# Altium project Oscilloscope.PrjPcb
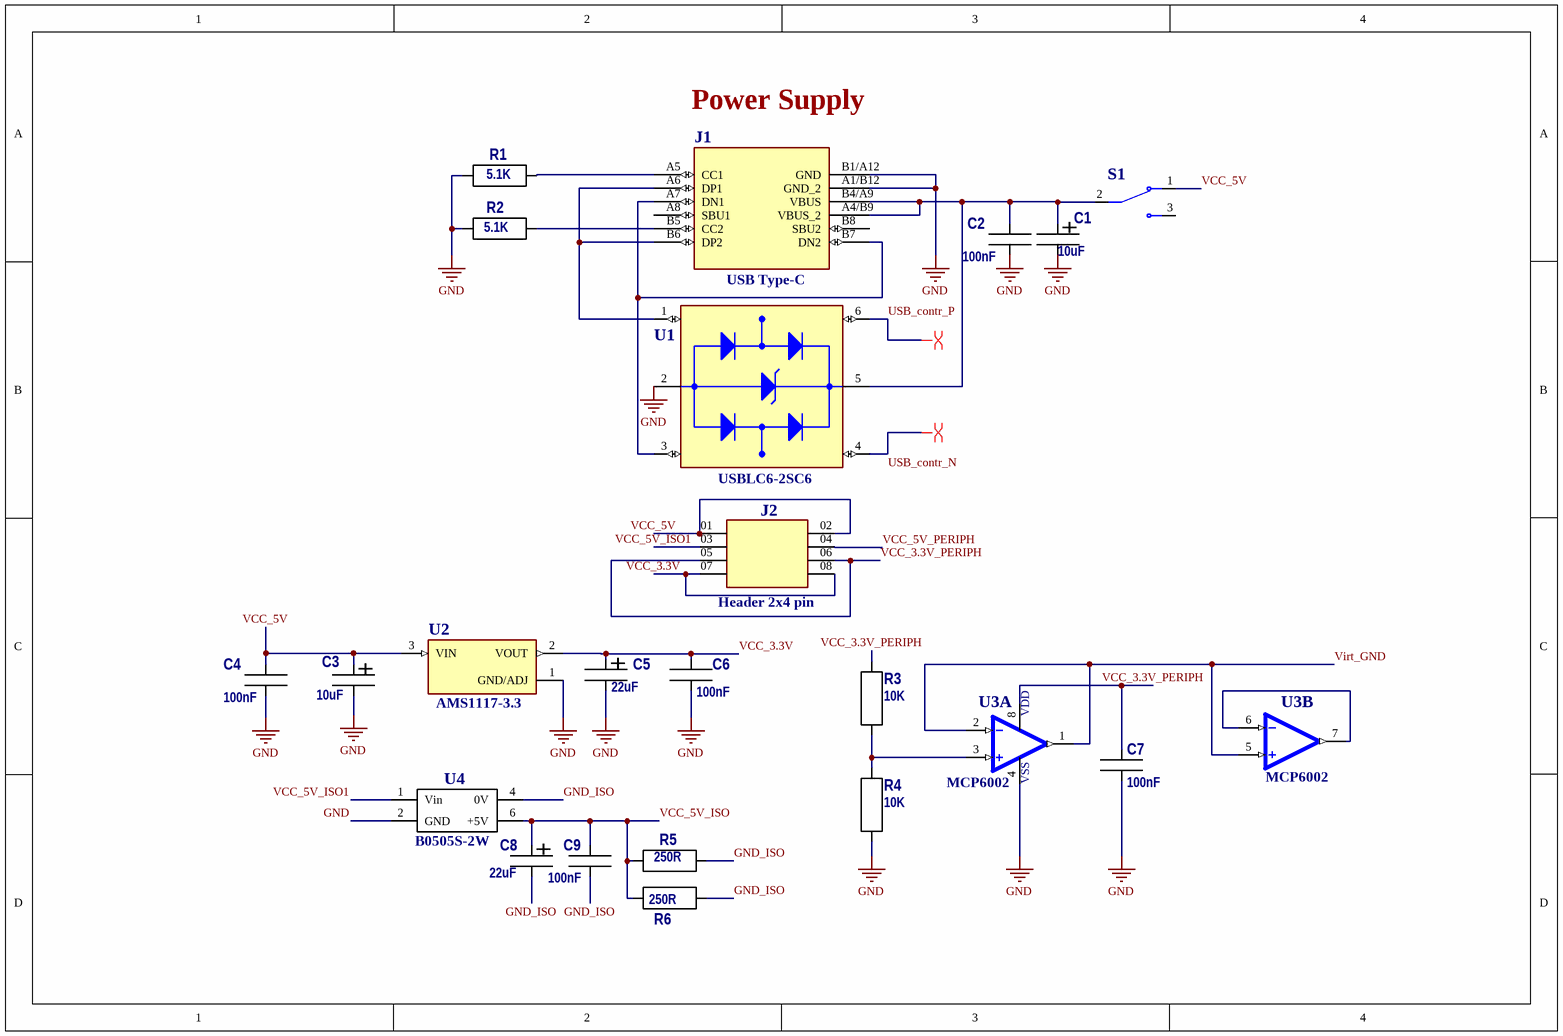
[diagram p0: Power_supply.SchDoc]
5 sheets, 124 parts. Net scope: global (net labels, ports and power ports of the same name join across sheets).
Board file: oscill_pcb.PcbDoc
Sheets:
  Power_supply.SchDoc
  Channel_input.SchDoc
  Relay_switcher.SchDoc
  ADC.SchDoc
  Controller.SchDoc

## Sheet Power_supply.SchDoc
size A4; SheetNumber: 1; SheetTotal: 5

### Parts
C1  10uF  [Tant B]
C2  100nF  [Cap 0805 3D]
C3  10uF  [Tant B]
C4  100nF  [Cap 0805 3D]
C5  22uF  [Tant B]
C6  100nF  [Cap 0805 3D]
C7  100nF  [Cap 0805 3D]
C8  22uF  [Tant B]
C9  100nF  [Cap 0805 3D]
J1  USB Type-C  [216990-0002_MOL]
J2  Header 2x4 pin  [SAMTEC_TSW-104-08-T-D]
R1  5.1K  [Res_0805 3D]
R2  5.1K  [Res_0805 3D]
R3  10K  [Res_1206 3D]
R4  10K  [Res_1206 3D]
R5  250R  [Res_1206 3D]
R6  250R  [Res_1206 3D]
S1  STS121RA04  [TE_STS121RA04]  (value not drawn)
U1  USBLC6-2SC6  [SOT95P280X145-6N]
U2  AMS1117-3.3  [SOT229P700X180-4N]
U3  MCP6002  [SOIC127P600X175-8N]  (parts A,B of 2)
U4  B0505S-2W  [B0505S-2W]

### Nets
GND: C1.2(-) C2.2 C3.2(-) C4.2 C5.2(-) C6.2 C7.2 J1.A1/B12(GND_2) J1.B1/A12(GND) R1.2 R2.2 R4.1 U1.2(GND) U2.1(GND/ADJ) U3.4(VSS) U4.2(GND)
GND_ISO: C8.2(-) C9.2 R5.1 R6.1 U4.4(0V)
USB_contr_N: U1.4(I/O2_OUT)
USB_contr_P: U1.6(I/O1_OUT)
VCC_3.3V: C5.1(+) C6.1 J2.07 J2.08 U2.2(VOUT)
VCC_3.3V_PERIPH: C7.1 J2.05 J2.06 R3.2 U3.8(VDD)
VCC_5V: C3.1(+) C4.1 J2.01 J2.02 S1.1 U2.3(VIN)
VCC_5V_ISO: C8.1(+) C9.1 R5.2 R6.2 U4.6(+5V)
VCC_5V_ISO1: J2.03 U4.1(Vin)
VCC_5V_PERIPH: J2.04
Virt_GND: U3.1(VOUTA) U3.2(VINA-) U3.5(VINB+)
NetC1_1: C1.1(+) C2.1 J1.A4/B9(VBUS_2) J1.B4/A9(VBUS) S1.2 U1.5(VBUS)
NetJ1_A5: J1.A5(CC1) R1.1
NetJ1_A6: J1.A6(DP1) J1.B6(DP2) U1.1(I/O1_IN)
NetJ1_A7: J1.A7(DN1) J1.B7(DN2) U1.3(I/O2_IN)
NetJ1_B5: J1.B5(CC2) R2.1
NetR3_1: R3.1 R4.2 U3.3(VINA+)
NetU3_6: U3.6(VINB-) U3.7(VOUTB)

Not connected (* = marked no-connect by the designer): J1 A8(SBU1) B8(SBU2); S1 3

### Layout directives
differential pair: USB_contr_N, USB_contr_P

### Notes on the sheet
- Power Supply

### Library data of the parts
C1 C3 = C T: SMD type B 10 uF min 16V
C2 C4 C6 C7 C9 = C: SMD 0805 100nF
C5 C8 = C T: SMD type B 22 uF min 16V
J1 = 2169900002: MF: {'manufacturer': u'Molex'}; Package: None; Price: None; Value: *; MP: 2169900002; Availability: Unavailable
J2 = TSW-104-08-T-D: Package: None; Price: None; Value: *; MP: TSW-104-08-T-D; Availability: Unavailable
R1 R2 = R: 0603 0.1%
R3-R6 = R: 0805 10K
S1 = STS121RA04: Slide Switch SPDT Through Hole, Right Angle; MF: TE Connectivity; SnapEDA_Link: https://www.snapeda.com/parts/STS121RA04/TE+Connectivity+ALCOSWITCH+Switches/view-part/?ref=snap; Package: None; Value: *; MP: STS121RA04; Check_prices: https://www.snapeda.com/parts/STS121RA04/TE+Connectivity+ALCOSWITCH+Switches/view-part/?ref=eda
U1 = USBLC6-2SC6: 17V Clamp 5A (8/20Âµs) Ipp Tvs Diode Surface Mount SOT-23-6; MF: STMicroelectronics; Value: *; SnapEDA_Link: https://www.snapeda.com/parts/USBLC6-2SC6/STMicroelectronics/view-part/?ref=snap; Check_prices: https://www.snapeda.com/parts/USBLC6-2SC6/STMicroelectronics/view-part/?ref=eda; Purchase-URL: https://pricing.snapeda.com/search/part/USBLC6-2SC6/?ref=eda; Price: None; Availability: In Stock; Package: SOT-23-6 STMicroelectronics; MP: USBLC6-2SC6
U2 = AMS1117-5.0: 1A LOW DROPOUT VOLTAGE REGULATOR; MF: ams; MP: AMS1117-5.0; Package: SOT-223 Seeed Technology; SnapEDA_Link: https://www.snapeda.com/parts/AMS1117-5.0/ams/view-part/?ref=snap; Check_prices: https://www.snapeda.com/parts/AMS1117-5.0/ams/view-part/?ref=eda; Availability: Not in stock; Value: *; Price: None
U3 = MCP6002-I/SN: Microchip , Dual Op Amp, 1MHzCMOS, Rail to Rail, 3V, 5V, 8-Pin SOIC | Microchip Technology Inc. MCP6002-I/SN; SnapEDA_Link: https://www.snapeda.com/parts/MCP6002-I/SN/Microchip/view-part/?ref=snap; Package: SO-8 Microchip; Value: *; MF: Microchip; MP: MCP6002-I/SN; Check_prices: https://www.snapeda.com/parts/MCP6002-I/SN/Microchip/view-part/?ref=eda
U4 = B0505S-2W: Изолированный DC-DC преобразователь, вход 5В, выход 5В 3Вт

## Sheet Channel_input.SchDoc
size A4; SheetNumber: 2; SheetTotal: 5
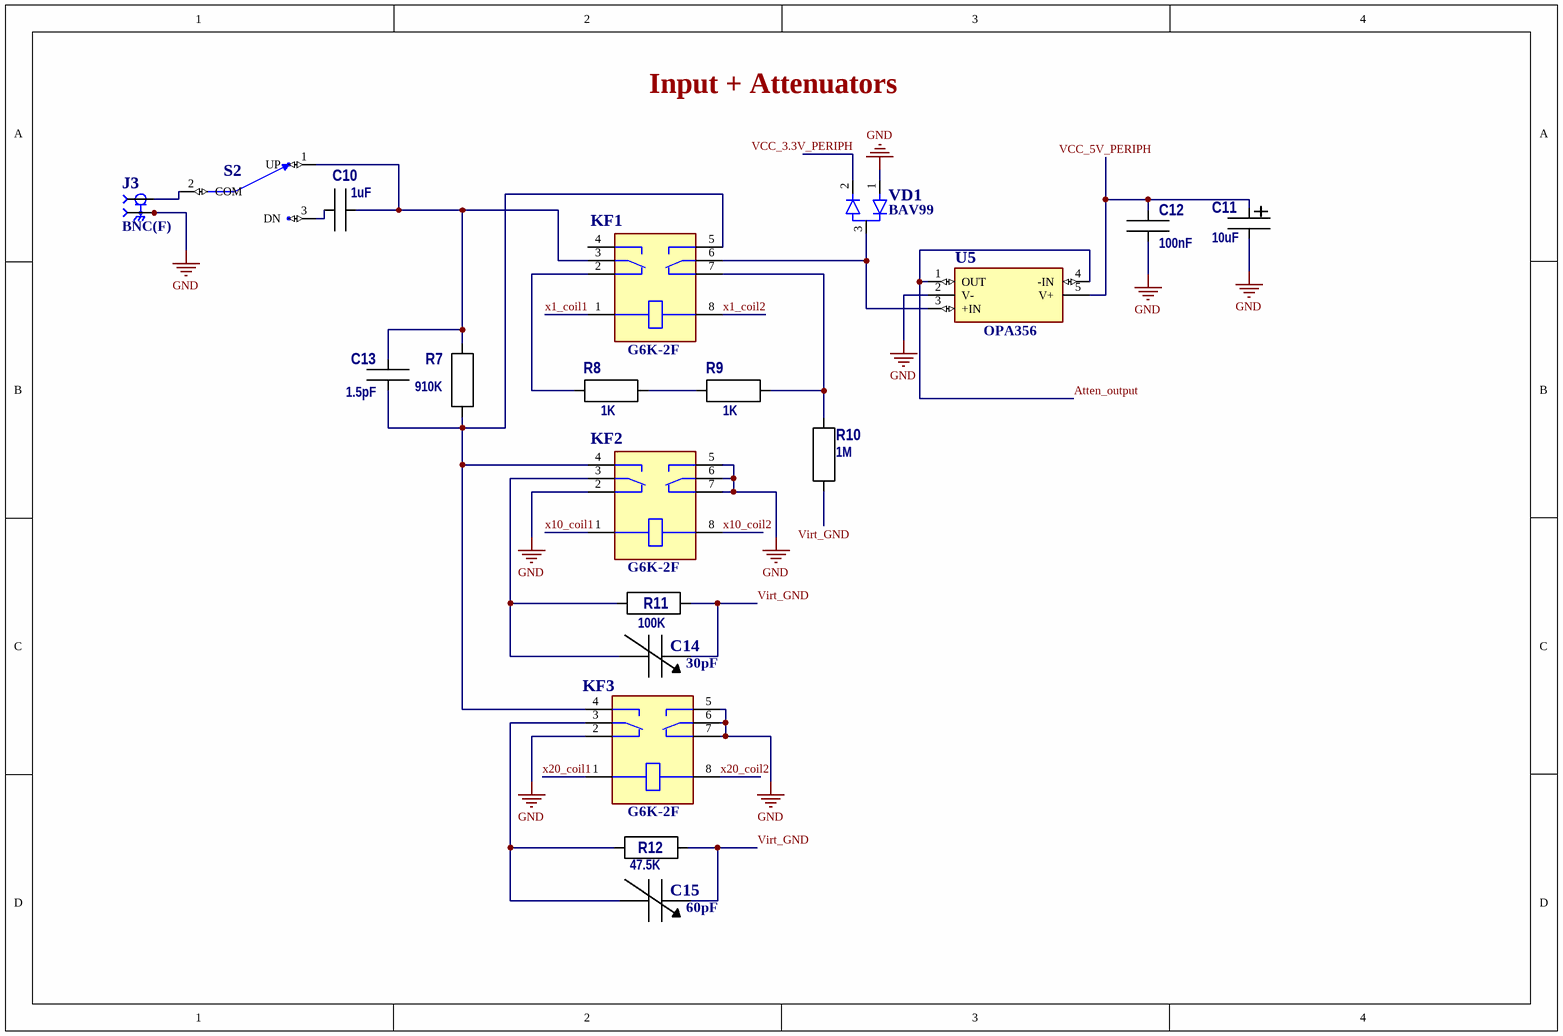
[diagram p1: Channel_input.SchDoc]

### Parts
C10  1uF  [C__s 5-d 5.5-t4]
C11  10uF  [Tant B]
C12  100nF  [CAP 0603 3D]
C13  1.5pF  [CAP 0603 3D]
C14  30pF  [Cvar]
C15  60pF  [Cvar]
J3  BNC(F)  [SAMTEC_BNC7T-J-P-XX-RA-BH1]
KF1  G6K-2F  [RELAY_G6K-2F]
KF2  G6K-2F  [RELAY_G6K-2F]
KF3  G6K-2F  [RELAY_G6K-2F]
R7  910K  [Res_1206 3D]
R8  1K  [Res_1206 3D]
R9  1K  [Res_1206 3D]
R10  1M  [Res_1206 3D]
R11  100K  [Res_1206 3D]
R12  47.5K  [Res_1206 3D]
S2  100SP1T1B1M7QE  [100SP1T1B1M7QE]  (value not drawn)
U5  OPA356  [SOT95P280X145-5N]
VD1  BAV99  [DIO_BAV99]

### Nets
GND: C11.2(-) C12.2 J3.S1 J3.S2 J3.S3 J3.S4 KF2.2 KF2.5 KF2.6 KF2.7 KF3.2 KF3.5 KF3.6 KF3.7 U5.2(V-) VD1.1
Atten_output: U5.1(OUT) U5.4(-IN)
VCC_3.3V_PERIPH: VD1.2
VCC_5V_PERIPH: C11.1(+) C12.1 U5.5(V+)
Virt_GND: C14.1 C15.1 R10.1 R11.2 R12.2
x1_coil2: KF1.8
x10_coil1: KF1.1 KF2.1 KF3.1  [also labelled x1_coil1, x20_coil1]  [project net VCC_5V_ISO]
x10_coil2: KF2.8
x20_coil2: KF3.8
NetC10_1: C10.1 C13.2 KF1.3 R7.2 S2.1(UP)
NetC10_2: C10.2 S2.3(DN)
NetC13_1: C13.1 KF1.5 KF2.4 KF3.4 R7.1
NetC14_2: C14.2 KF2.3 R11.1
NetC15_2: C15.2 KF3.3 R12.1
NetJ3_1: J3.1 S2.2(COM)
NetKF1_2: KF1.2 R8.2
NetKF1_6: KF1.6 U5.3(+IN) VD1.3
NetKF1_7: KF1.7 R9.1 R10.2
NetR8_1: R8.1 R9.2

Not connected (* = marked no-connect by the designer): KF1 4

### Notes on the sheet
- Input + Attenuators

### Library data of the parts
C10 = C_Disk: Конденсатор керамика
C11 = C T: SMD type B 10 uF min 16V
C12 = C: 0603 100nF X7R
C13 = C: 0603 1.5pF X7R
C14 C15 = Сvar
J3 = BNC7T-J-P-XX-RA-BH1: Connecteur BNC Jack, Embase femelle 75Ohm Montage sur panneau, Traversant, Soudure Ã  angle droit; MP: BNC7T-J-P-HN-RA-BH1; MF: Samtec; Check_prices: https://www.snapeda.com/parts/BNC7T-J-P-HN-RA-BH1/Samtec+Inc./view-part/?ref=eda; Value: *; Availability: In Stock; Price: None; Package: None; SnapEDA_Link: https://www.snapeda.com/parts/BNC7T-J-P-HN-RA-BH1/Samtec+Inc./view-part/?ref=snap; Purchase-URL: https://pricing.snapeda.com/search/part/BNC7T-J-P-HN-RA-BH1/?ref=eda
KF1-KF3 = G6K-2F: Telecom Relay DPDT (2 Form C) Surface Mount; MF: Omron; SnapEDA_Link: https://www.snapeda.com/parts/G6K-2F/Omron/view-part/?ref=snap; Package: TDFN-6 Omron Electronics; Value: *; MP: G6K-2F; Check_prices: https://www.snapeda.com/parts/G6K-2F/Omron/view-part/?ref=eda
R7 = R: 1206 910K
R8 R9 = R: 1 KOhm 1206
R10 = R: 1 MOhm 1206
R11 = R: 100 KOhm 1206
R12 = R: 47.5 KOhm 1206
S2 = 100SP1T1B1M7QE: TOGGLE, 5A, 120VAC/28VDC SPDT, On-On, Panel Mount, Right Angle, Vertical; MF: E-Switch; SnapEDA_Link: https://www.snapeda.com/parts/100SP1T1B1M7QE/E-Switch/view-part/?ref=snap; Package: None; Value: *; MP: 100SP1T1B1M7QE; Check_prices: https://www.snapeda.com/parts/100SP1T1B1M7QE/E-Switch/view-part/?ref=eda
U5 = OPA356AIDBVR: 2.5V, 200MHz GBW, CMOS Single Op Amp; MF: Texas Instruments; SnapEDA_Link: https://www.snapeda.com/parts/OPA356AIDBVR/Texas+Instruments/view-part/?ref=snap; Package: SOT-23-5 Texas Instruments; Value: *; MP: OPA356AIDBVR; Check_prices: https://www.snapeda.com/parts/OPA356AIDBVR/Texas+Instruments/view-part/?ref=eda
VD1 = BAV99: Diode Array 1 Pair Series Connection Standard 100V 215mA (DC) Surface Mount TO-236-3, SC-59, SOT-23-3; MF: ON Semiconductor; Price: None; Availability: In Stock; MP: BAV99; Package: SOT-23-3 Motorola; SnapEDA_Link: https://www.snapeda.com/parts/BAV99/Onsemi/view-part/?ref=snap; Check_prices: https://www.snapeda.com/parts/BAV99/Onsemi/view-part/?ref=eda; Value: *; Purchase-URL: https://pricing.snapeda.com/search/part/BAV99/?ref=eda

## Sheet Relay_switcher.SchDoc
size A4; SheetNumber: 3; SheetTotal: 5
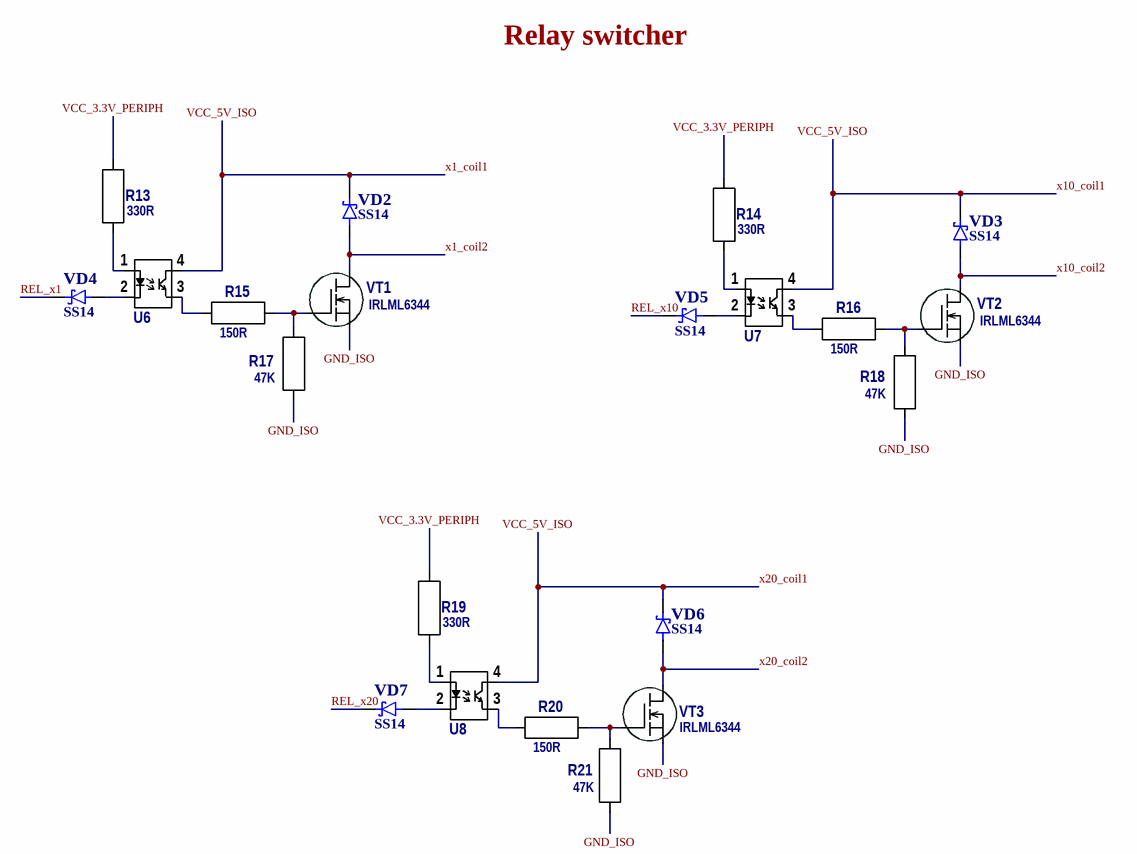
[diagram p2: Relay_switcher.SchDoc]

### Parts
R13  330R  [Res_1206 3D]
R14  330R  [Res_1206 3D]
R15  150R  [Res_1206 3D]
R16  150R  [Res_1206 3D]
R17  47K  [Res_1206 3D]
R18  47K  [Res_1206 3D]
R19  330R  [Res_1206 3D]
R20  150R  [Res_1206 3D]
R21  47K  [Res_1206 3D]
U6  Optocoupler EL817 DIP-4  [DIP-4]  (value not drawn)
U7  Optocoupler EL817 DIP-4  [DIP-4]  (value not drawn)
U8  Optocoupler EL817 DIP-4  [DIP-4]  (value not drawn)
VD2  SS14  [SMA]
VD3  SS14  [SMA]
VD4  SS14  [SMA]
VD5  SS14  [SMA]
VD6  SS14  [SMA]
VD7  SS14  [SMA]
VT1  IRLML6344  [SOT-23-3]
VT2  IRLML6344  [SOT-23-3]
VT3  IRLML6344  [SOT-23-3]

### Nets
GND_ISO: R17.2 R18.2 R21.2 VT1.3(S) VT2.3(S) VT3.3(S)
REL_x1: VD4.P2(C)
REL_x10: VD5.P2(C)
REL_x20: VD7.P2(C)
VCC_3.3V_PERIPH: R13.2 R14.2 R19.2
VCC_5V_ISO: U6.4(C) U7.4(C) U8.4(C) VD2.P2(C) VD3.P2(C) VD6.P2(C)  [also labelled x10_coil1, x1_coil1, x20_coil1]
x1_coil2: VD2.P1(A) VT1.2(D)
x10_coil2: VD3.P1(A) VT2.2(D)
x20_coil2: VD6.P1(A) VT3.2(D)
NetR13_1: R13.1 U6.1(Led_A)
NetR14_1: R14.1 U7.1(Led_A)
NetR15_1: R15.1 U6.3(E)
NetR15_2: R15.2 R17.1 VT1.1(G)
NetR16_1: R16.1 U7.3(E)
NetR16_2: R16.2 R18.1 VT2.1(G)
NetR19_1: R19.1 U8.1(Led_A)
NetR20_1: R20.1 U8.3(E)
NetR20_2: R20.2 R21.1 VT3.1(G)
NetU6_2: U6.2(Led_C) VD4.P1(A)
NetU7_2: U7.2(Led_C) VD5.P1(A)
NetU8_2: U8.2(Led_C) VD7.P1(A)

### Notes on the sheet
- Relay switcher

### Library data of the parts
R13-R21 = R
U6-U8 = EL817: Оптрон выход - транзистор
VD2-VD7 = SS14: Diode Schottky 40 V 1A Surface Mount DO-214AC (SMA); MF: ON; SnapEDA_Link: https://www.snapeda.com/parts/SS14/Onsemi/view-part/?ref=snap; Package: SMA-2 ON Semiconductor; Value: *; MP: SS14; Check_prices: https://www.snapeda.com/parts/SS14/Onsemi/view-part/?ref=eda
VT1-VT3 = VT MOSFET-N: Транзистор MOSFET N-канал IRLML6344

## Sheet ADC.SchDoc
size A4; SheetNumber: 4; SheetTotal: 5
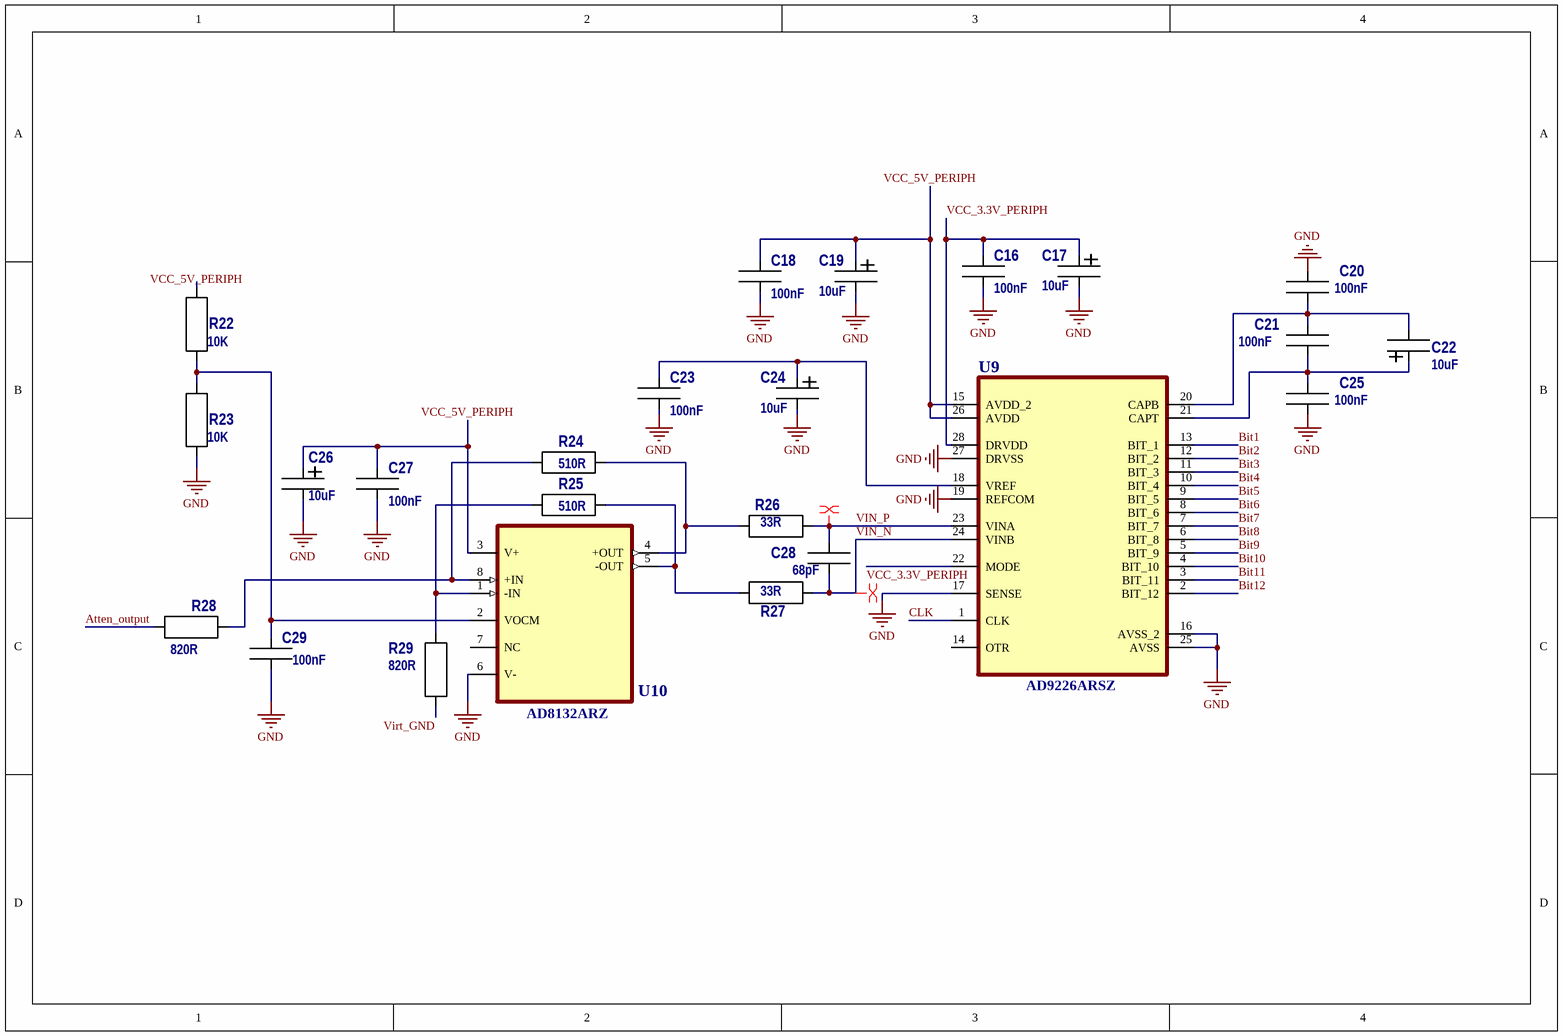
[diagram p3: ADC.SchDoc]

### Parts
C16  100nF  [CAP 0603 3D]
C17  10uF  [Tant B]
C18  100nF  [CAP 0603 3D]
C19  10uF  [Tant B]
C20  100nF  [CAP 0603 3D]
C21  100nF  [CAP 0603 3D]
C22  10uF  [Tant B]
C23  100nF  [CAP 0603 3D]
C24  10uF  [Tant B]
C25  100nF  [CAP 0603 3D]
C26  10uF  [Tant B]
C27  100nF  [cap 1206 3D]
C28  68pF  [CAP 0603 3D]
C29  100nF  [CAP 0603 3D]
R22  10K  [Res_0603 3D]
R23  10K  [Res_0603 3D]
R24  510R  [Res_0603 3D]
R25  510R  [Res_0603 3D]
R26  33R  [Res_0603 3D]
R27  33R  [Res_0603 3D]
R28  820R  [Res_0603 3D]
R29  820R  [Res_0603 3D]
U9  AD9226ARSZ  [SOP65P780X200-28N]
U10  AD8132ARZ  [SOIC127P600X175-8N]

### Nets
GND: C16.2 C17.2(-) C18.2 C19.2(-) C20.1 C23.2 C24.2(-) C25.2 C26.2(-) C27.2 C29.2 R23.1 U9.16(AVSS_2) U9.17(SENSE) U9.19(REFCOM) U9.25(AVSS) U9.27(DRVSS) U10.6(V-)
Atten_output: R28.2
Bit1: U9.13(BIT_1)
Bit2: U9.12(BIT_2)
Bit3: U9.11(BIT_3)
Bit4: U9.10(BIT_4)
Bit5: U9.9(BIT_5)
Bit6: U9.8(BIT_6)
Bit7: U9.7(BIT_7)
Bit8: U9.6(BIT_8)
Bit9: U9.5(BIT_9)
Bit10: U9.4(BIT_10)
Bit11: U9.3(BIT_11)
Bit12: U9.2(BIT_12)
CLK: U9.1(CLK)
VCC_3.3V_PERIPH: C16.1 C17.1(+) U9.22(MODE) U9.28(DRVDD)
VCC_5V_PERIPH: C18.1 C19.1(+) C26.1(+) C27.1 R22.2 U9.15(AVDD_2) U9.26(AVDD) U10.3(V+)
VIN_N: C28.2 R27.1 U9.24(VINB)
VIN_P: C28.1 R26.1 U9.23(VINA)
Virt_GND: R29.2
NetC20_2: C20.2 C21.1 C22.2(-) U9.20(CAPB)
NetC21_2: C21.2 C22.1(+) C25.1 U9.21(CAPT)
NetC23_1: C23.1 C24.1(+) U9.18(VREF)
NetC29_1: C29.1 R22.1 R23.2 U10.2(VOCM)
NetR24_1: R24.1 R26.2 U10.4(+OUT)
NetR24_2: R24.2 R28.1 U10.8(+IN)
NetR25_1: R25.1 R27.2 U10.5(-OUT)
NetR25_2: R25.2 R29.1 U10.1(-IN)

Not connected (* = marked no-connect by the designer): U9 14(OTR); U10 7(NC)

### Layout directives
differential pair: VIN_N, VIN_P

### Library data of the parts
C16 C18 C20 C21 C23 C25 C27 C29 = C: 0603 100nF X7R
C17 C19 C22 C24 C26 = C T: SMD type B 10 uF min 16V
C28 = C: 0805 68pF NP0 (C0G)
R22 R23 = R: 10K 0805
R24-R29 = R: 0805 0.1%
U9 = AD9226ARSZ: 12-Bit, 65 MSPS Analog-to-Digital Converter; MF: Analog Devices; SnapEDA_Link: https://www.snapeda.com/parts/AD9226ARSZ/Analog+Devices/view-part/?ref=snap; Package: SSOP-28 Analog Devices; Value: *; MP: AD9226ARSZ; Check_prices: https://www.snapeda.com/parts/AD9226ARSZ/Analog+Devices/view-part/?ref=eda
U10 = AD8132ARZ: Low Cost, High Speed Differential Amplifier; MF: Analog Devices; SnapEDA_Link: https://www.snapeda.com/parts/AD8132ARZ/Analog+Devices/view-part/?ref=snap; Package: SOIC-8 Analog Devices; Value: *; MP: AD8132ARZ; Check_prices: https://www.snapeda.com/parts/AD8132ARZ/Analog+Devices/view-part/?ref=eda

## Sheet Controller.SchDoc
size A4; SheetNumber: 5; SheetTotal: 5
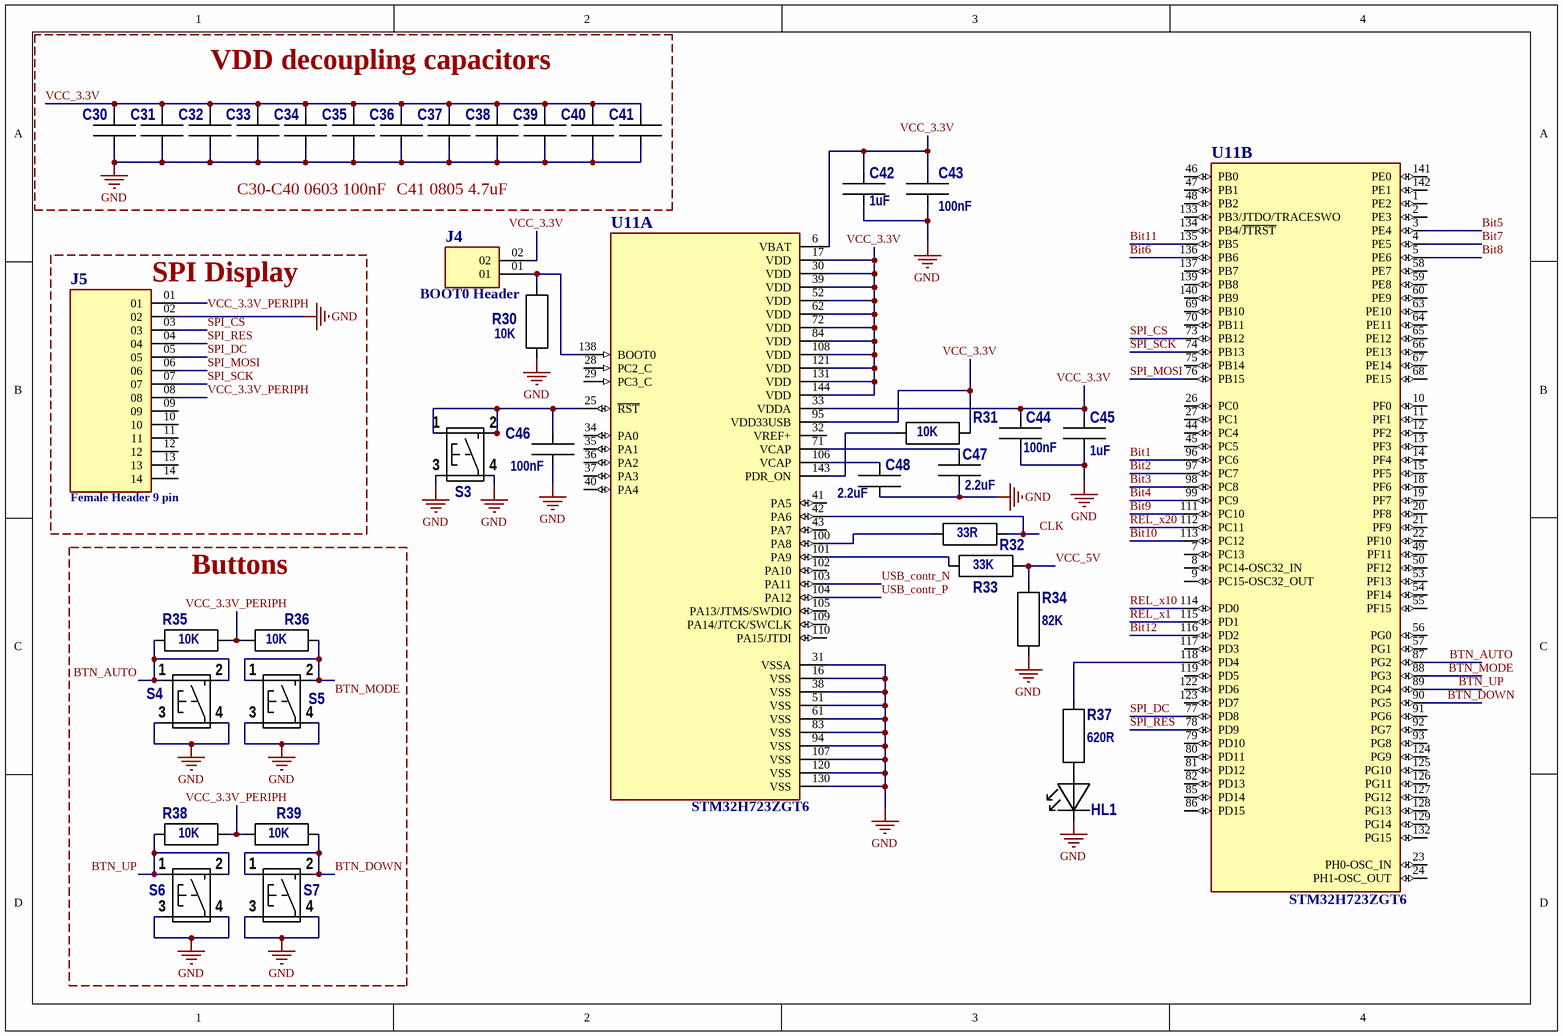
[diagram p4: Controller.SchDoc]

### Parts
C30  100nF  [CAP 0603 3D]  (value not drawn)
C31  100nF  [CAP 0603 3D]  (value not drawn)
C32  100nF  [CAP 0603 3D]  (value not drawn)
C33  100nF  [CAP 0603 3D]  (value not drawn)
C34  100nF  [CAP 0603 3D]  (value not drawn)
C35  100nF  [CAP 0603 3D]  (value not drawn)
C36  100nF  [CAP 0603 3D]  (value not drawn)
C37  100nF  [CAP 0603 3D]  (value not drawn)
C38  100nF  [CAP 0603 3D]  (value not drawn)
C39  100nF  [CAP 0603 3D]  (value not drawn)
C40  100nF  [CAP 0603 3D]  (value not drawn)
C41  4.7uF  [Cap 0805 3D]  (value not drawn)
C42  1uF  [Cap 0805 3D]
C43  100nF  [CAP 0603 3D]
C44  100nF  [CAP 0603 3D]
C45  1uF  [Cap 0805 3D]
C46  100nF  [CAP 0603 3D]
C47  2.2uF  [Cap 0805 3D]
C48  2.2uF  [Cap 0805 3D]
HL1  fyls-0805???  [СД_SMD 2012_110]  (value not drawn)
J4  BOOT0 Header  [SAMTEC_HTSW-102-07-TM-S]
J5  Female Header 9 pin  [SAMTEC_SSQ-114-02-T-S]
R30  10K  [Res_0603 3D]
R31  10K  [Res_0603 3D]
R32  33R  [Res_0603 3D]
R33  33K  [Res_0603 3D]
R34  82K  [Res_0603 3D]
R35  10K  [Res_0603 3D]
R36  10K  [Res_0603 3D]
R37  620R  [Res_0603 3D]
R38  10K  [Res_0603 3D]
R39  10K  [Res_0603 3D]
S3  SWT-20-12.5  [250 _ 6,0-6,0-12,5]  (value not drawn)
S4  SWT-20-12.5  [250 _ 6,0-6,0-12,5]  (value not drawn)
S5  SWT-20-12.5  [250 _ 6,0-6,0-12,5]  (value not drawn)
S6  SWT-20-12.5  [250 _ 6,0-6,0-12,5]  (value not drawn)
S7  SWT-20-12.5  [250 _ 6,0-6,0-12,5]  (value not drawn)
U11  STM32H723ZGT6  [QFP50P2200X2200X160-144N]  (parts A,B of 2)

### Blocks framed on the sheet
VDD decoupling capacitors: C30-C41
SPI Display: J5
Buttons: R35 R36 R38 R39 S4-S7

### Nets
GND: C30.1 C31.1 C32.1 C33.1 C34.1 C35.1 C36.1 C37.1 C38.1 C39.1 C40.2 C41.1 C42.1 C43.2 C44.2 C45.1 C46.2 C47.1 C48.1 HL1.1(K) J5.02 R30.1 R34.2 S3.3 S3.4 S4.3 S4.4 S5.3 S5.4 S6.3 S6.4 S7.3 S7.4 U11.16(VSS) U11.31(VSSA) U11.38(VSS) U11.51(VSS) U11.61(VSS) U11.83(VSS) U11.94(VSS) U11.107(VSS) U11.120(VSS) U11.130(VSS)
Bit1: U11.96(PC6)
Bit2: U11.97(PC7)
Bit3: U11.98(PC8)
Bit4: U11.99(PC9)
Bit5: U11.3(PE4)
Bit6: U11.136(PB6)
Bit7: U11.4(PE5)
Bit8: U11.5(PE6)
Bit9: U11.111(PC10)
Bit10: U11.113(PC12)
Bit11: U11.135(PB5)
Bit12: U11.116(PD2)
BTN_AUTO: R35.2 S4.1 S4.2 U11.87(PG2)
BTN_DOWN: R39.1 S7.1 S7.2 U11.90(PG5)
BTN_MODE: R36.1 S5.1 S5.2 U11.88(PG3)
BTN_UP: R38.2 S6.1 S6.2 U11.89(PG4)
CLK: R32.1 U11.42(PA6)
REL_x1: U11.115(PD1)
REL_x10: U11.114(PD0)
REL_x20: U11.112(PC11)
SPI_CS: J5.03 U11.73(PB12)
SPI_DC: J5.05 U11.77(PD8)
SPI_MOSI: J5.06 U11.76(PB15)
SPI_RES: J5.04 U11.78(PD9)
SPI_SCK: J5.07 U11.74(PB13)
USB_contr_N: U11.103(PA11)
USB_contr_P: U11.104(PA12)
VCC_3.3V: C30.2 C31.2 C32.2 C33.2 C34.2 C35.2 C36.2 C37.2 C38.2 C39.2 C40.1 C41.2 C42.2 C43.1 C44.1 C45.2 J4.02 R31.1 U11.6(VBAT) U11.17(VDD) U11.30(VDD) U11.33(VDDA) U11.39(VDD) U11.52(VDD) U11.62(VDD) U11.72(VDD) U11.84(VDD) U11.95(VDD33USB) U11.108(VDD) U11.121(VDD) U11.131(VDD) U11.144(VDD)
VCC_3.3V_PERIPH: J5.01 J5.08 R35.1 R36.2 R38.1 R39.2
VCC_5V: R33.1 R34.1
NetC46_1: C46.1 S3.1 S3.2 U11.25(~{RST})
NetC47_2: C47.2 U11.71(VCAP)
NetC48_2: C48.2 U11.106(VCAP)
NetHL1_2: HL1.2(A) R37.2
NetJ4_01: J4.01 R30.2 U11.138(BOOT0)
NetR31_2: R31.2 U11.143(PDR_ON)
NetR32_2: R32.2 U11.100(PA8)
NetR33_2: R33.2 U11.101(PA9)
NetR37_1: R37.1 U11.118(PD4)

Not connected (* = marked no-connect by the designer): J5 09 10 11 12 13 14; U11 1(PE2) 2(PE3) 7(PC13) 8(PC14-OSC32_IN) 9(PC15-OSC32_OUT) 10(PF0) 11(PF1) 12(PF2) 13(PF3) 14(PF4) 15(PF5) 18(PF6) 19(PF7) 20(PF8) 21(PF9) 22(PF10) 23(PH0-OSC_IN) 24(PH1-OSC_OUT) 26(PC0) 27(PC1) 28(PC2_C) 29(PC3_C) 32(VREF+) 34(PA0) 35(PA1) 36(PA2) 37(PA3) 40(PA4) 41(PA5) 43(PA7) 44(PC4) 45(PC5) 46(PB0) 47(PB1) 48(PB2) 49(PF11) 50(PF12) 53(PF13) 54(PF14) 55(PF15) 56(PG0) 57(PG1) 58(PE7) 59(PE8) 60(PE9) 63(PE10) 64(PE11) 65(PE12) 66(PE13) 67(PE14) 68(PE15) 69(PB10) 70(PB11) 75(PB14) 79(PD10) 80(PD11) 81(PD12) 82(PD13) 85(PD14) 86(PD15) 91(PG6) 92(PG7) 93(PG8) 102(PA10) 105(PA13/JTMS/SWDIO) 109(PA14/JTCK/SWCLK) 110(PA15/JTDI) 117(PD3) 119(PD5) 122(PD6) 123(PD7) 124(PG9) 125(PG10) 126(PG11) 127(PG12) 128(PG13) 129(PG14) 132(PG15) 133(PB3/JTDO/TRACESWO) 134(PB4/~{JTRST}) 137(PB7) 139(PB8) 140(PB9) 141(PE0) 142(PE1)

### Notes on the sheet
- C30-C40 0603 100nF
- C41 0805 4.7uF

### Library data of the parts
C30-C40 = C: 0805 100nF X7R
C41 = C: 0805 4.7 uF min 6V
C42 = C: 0805 1uF min 6V
C43 C44 C46 = C: 0603 100nF X7R
C45 = C: 0805 1 uF X7R
C47 C48 = C: 0805 2.2 uF X7R ESR<100 mOhm
HL1 = fyls-0805....: Св. д. ЧИП 2012 (0805)
J4 = HTSW-102-07-TM-S: HEADER, 2 CONTACTS, 1 ROW, THROUGH HOLE, 2.54 MM; Connector Systems:Board-to-Board; Pitch Spacing:2.54mm; No. of Rows:1Rows; No. of Contacts:2Contacts; Contact Termination Type:Through Hole; Product Range:HTSW Series; Gender:Header RoHS Compliant: Yes; MP: HTSW10207TMS; MF: Samtec; SnapEDA_Link: https://www.snapeda.com/parts/HTSW10207TMS/Samtec/view-part/?ref=snap; Value: *; Purchase-URL: https://pricing.snapeda.com/search/part/HTSW10207TMS/?ref=eda; Availability: In Stock; Check_prices: https://www.snapeda.com/parts/HTSW10207TMS/Samtec/view-part/?ref=eda; Package: None; Price: None
J5 = SSQ-114-02-T-S: CONNECTOR, RECEPTACLE, 14 CONTACTS, 1 ROW, THROUGH HOLE, 2.54 MM; Connector Systems:Board-to-Board; Pitch Spacing:2.54mm; No. of Rows:1Rows; No. of Contacts:14Contacts; Connector Mounting:Through Hole Mount; Product Range:SSQ Series RoHS Compliant: Yes; MF: Samtec; MP: SSQ11402TS; Check_prices: https://www.snapeda.com/parts/SSQ11402TS/Samtec/view-part/?ref=eda; Package: None; Value: *; Price: None; Availability: In Stock; SnapEDA_Link: https://www.snapeda.com/parts/SSQ11402TS/Samtec/view-part/?ref=snap; Purchase-URL: https://pricing.snapeda.com/search/part/SSQ11402TS/?ref=eda
R30 R33-R36 R38 R39 = R: 0603 1%
R31 R37 = R: 0603 1% 620R
R32 = R: 0603 0.1%
S3-S7 = 1_SWT-20-12.5: Кнопка тактовая
U11 = STM32H723ZGT6: ARMÂ® CortexÂ®-M7 STM32H7 Microcontroller IC 32-Bit Single-Core 550MHz 1MB (1M x 8) FLASH 144-LQFP (20x20); MF: STMicroelectronics; SnapEDA_Link: https://www.snapeda.com/parts/STM32H723ZGT6/STMicroelectronics/view-part/?ref=snap; Package: LQFP-144 STMicroelectronics; Value: *; MP: STM32H723ZGT6; Check_prices: https://www.snapeda.com/parts/STM32H723ZGT6/STMicroelectronics/view-part/?ref=eda

## Nets that join several sheets
GND: Power_supply (16 pins), Channel_input (16 pins), ADC (18 pins), Controller (43 pins)
Atten_output: Channel_input (U5.1 U5.4), ADC (R28.2)
Bit1: ADC (U9.13), Controller (U11.96)
Bit2: ADC (U9.12), Controller (U11.97)
Bit3: ADC (U9.11), Controller (U11.98)
Bit4: ADC (U9.10), Controller (U11.99)
Bit5: ADC (U9.9), Controller (U11.3)
Bit6: ADC (U9.8), Controller (U11.136)
Bit7: ADC (U9.7), Controller (U11.4)
Bit8: ADC (U9.6), Controller (U11.5)
Bit9: ADC (U9.5), Controller (U11.111)
Bit10: ADC (U9.4), Controller (U11.113)
Bit11: ADC (U9.3), Controller (U11.135)
Bit12: ADC (U9.2), Controller (U11.116)
CLK: ADC (U9.1), Controller (R32.1 U11.42)
GND_ISO: Power_supply (5 pins), Relay_switcher (6 pins)
REL_x1: Relay_switcher (VD4.P2), Controller (U11.115)
REL_x10: Relay_switcher (VD5.P2), Controller (U11.114)
REL_x20: Relay_switcher (VD7.P2), Controller (U11.112)
USB_contr_N: Power_supply (U1.4), Controller (U11.103)
USB_contr_P: Power_supply (U1.6), Controller (U11.104)
VCC_3.3V: Power_supply (5 pins), Controller (32 pins)
VCC_3.3V_PERIPH: Power_supply (5 pins), Channel_input (VD1.2), Relay_switcher (R13.2 R14.2 R19.2), ADC (C16.1 C17.1 U9.22 U9.28), Controller (6 pins)
VCC_5V: Power_supply (6 pins), Controller (R33.1 R34.1)
VCC_5V_ISO: Power_supply (5 pins), Channel_input (KF1.1 KF2.1 KF3.1), Relay_switcher (6 pins)
VCC_5V_PERIPH: Power_supply (J2.04), Channel_input (C11.1 C12.1 U5.5), ADC (8 pins)
Virt_GND: Power_supply (U3.1 U3.2 U3.5), Channel_input (5 pins), ADC (R29.2)
x1_coil2: Channel_input (KF1.8), Relay_switcher (VD2.P1 VT1.2)
x10_coil2: Channel_input (KF2.8), Relay_switcher (VD3.P1 VT2.2)
x20_coil2: Channel_input (KF3.8), Relay_switcher (VD6.P1 VT3.2)